# EAGLE schematic matriz_8x8 (EAGLE 9.0.0)
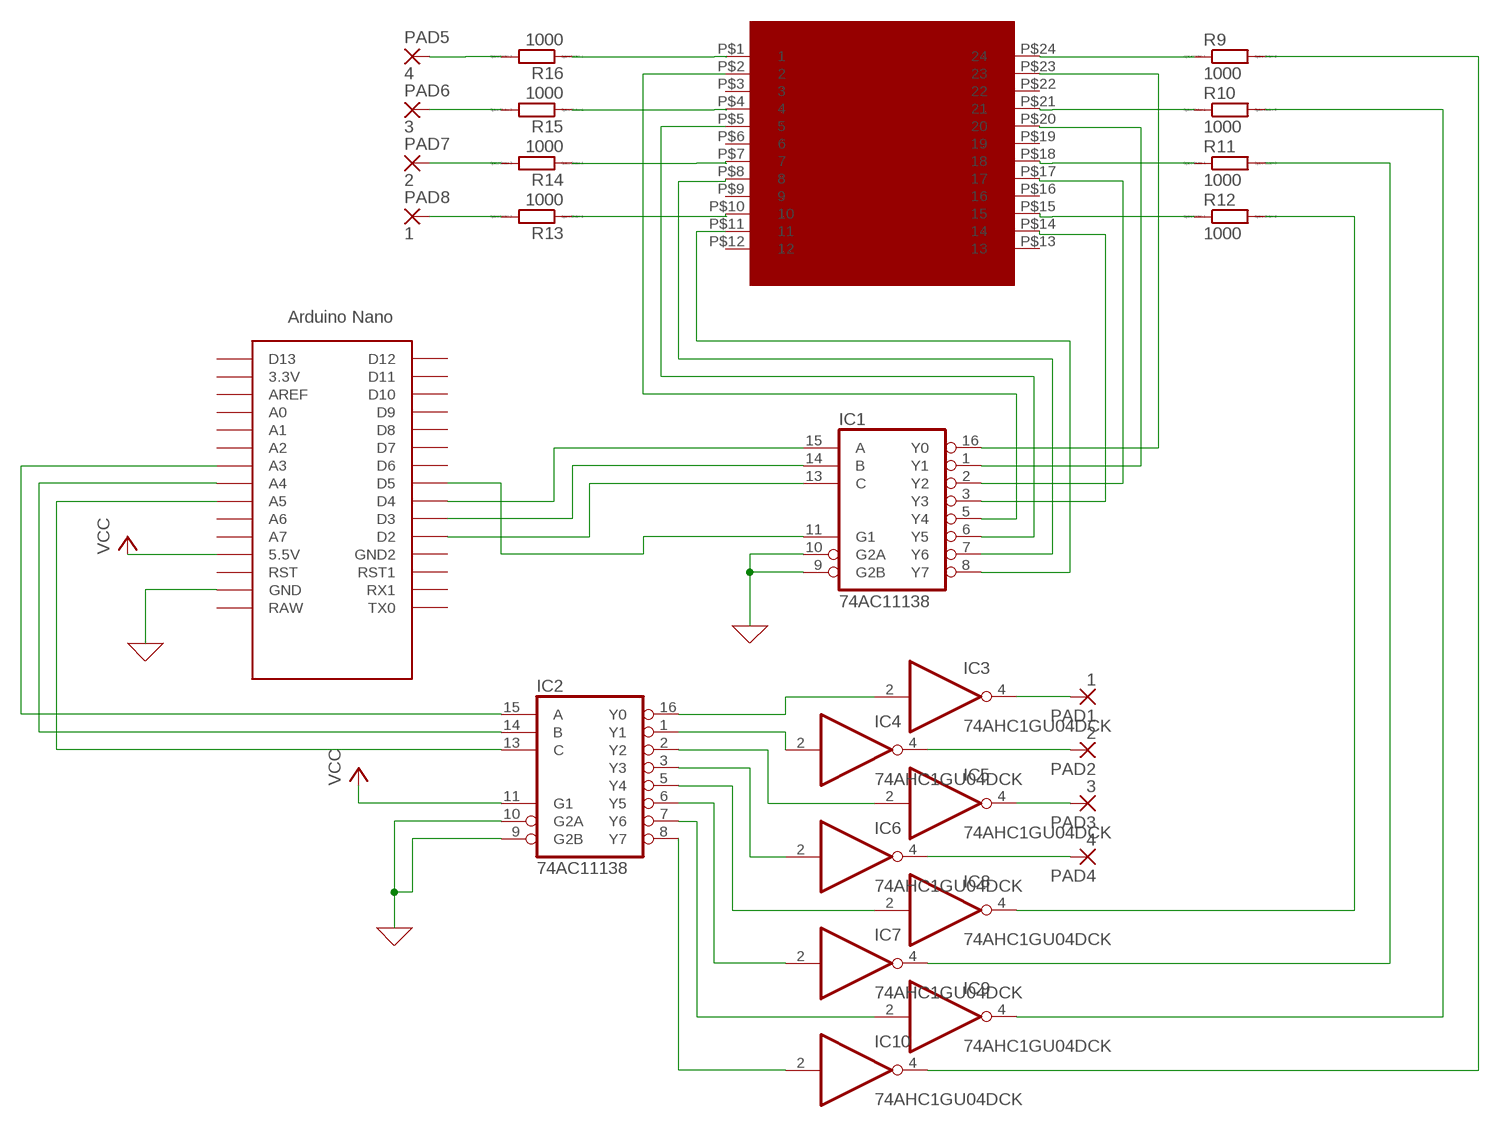
[diagram p0: schematic, sheet 1]

## Parts
IC1  74AC11138  [DIL16]
IC2  74AC11138  [DIL16]
IC3  74AHC1GU04DCK  [SC70-5]
IC4  74AHC1GU04DCK  [SC70-5]
IC5  74AHC1GU04DCK  [SC70-5]
IC6  74AHC1GU04DCK  [SC70-5]
IC7  74AHC1GU04DCK  [SC70-5]
IC8  74AHC1GU04DCK  [SC70-5]
IC9  74AHC1GU04DCK  [SC70-5]
IC10  74AHC1GU04DCK  [SC70-5]
PAD1  1  1,6/0,8  [1,6/0,8]
PAD2  2  1,6/0,8  [1,6/0,8]
PAD3  3  1,6/0,8  [1,6/0,8]
PAD4  4  1,6/0,8  [1,6/0,8]
PAD5  4  1,6/0,8  [1,6/0,8]
PAD6  3  1,6/0,8  [1,6/0,8]
PAD7  2  1,6/0,8  [1,6/0,8]
PAD8  1  1,6/0,8  [1,6/0,8]
R9  1000  R0204/7  [0204/7]
R10  1000  R0204/7  [0204/7]
R11  1000  R0204/7  [0204/7]
R12  1000  R0204/7  [0204/7]
R13  1000  R0204/7  [0204/7]
R14  1000  R0204/7  [0204/7]
R15  1000  R0204/7  [0204/7]
R16  1000  R0204/7  [0204/7]
U$1  8X8_BI_COLOR_MATRIX  [8X8_BI_COLOR_MATRIX]
U$2  NANO  [NANO]

## Nets
0: IC1.9(G2B) IC1.10(G2A) IC2.9(G2B) IC2.10(G2A) U$2.GND ; supply symbol labelled GND
N$1: IC1.11(G1) U$2.D5
N$9: R9.1 U$1.P$24
N$10: R10.1 U$1.P$21
N$11: R11.1 U$1.P$18
N$12: R12.1 U$1.P$15
N$13: R13.1 U$1.P$10
N$14: R14.1 U$1.P$7
N$15: R15.1 U$1.P$4
N$16: R16.1 U$1.P$1
N$17: IC2.13(C) U$2.A5
N$18: IC1.13(C) U$2.D2
N$19: IC1.14(B) U$2.D3
N$20: IC1.15(A) U$2.D4
N$21: IC2.15(A) U$2.A3
N$22: IC2.14(B) U$2.A4
N$23: IC2.16(Y0) IC3.2(I)
N$24: IC2.1(Y1) IC4.2(I)
N$25: IC2.2(Y2) IC5.2(I)
N$26: IC2.3(Y3) IC6.2(I)
N$27: IC2.5(Y4) IC8.2(I)
N$28: IC2.6(Y5) IC7.2(I)
N$29: IC2.7(Y6) IC9.2(I)
N$30: IC2.8(Y7) IC10.2(I)
N$31: PAD5.1(P) R16.2
N$32: PAD6.1(P) R15.2
N$33: PAD7.1(P) R14.2
N$34: PAD8.1(P) R13.2
N$35: IC1.8(Y7) U$1.P$11
N$36: IC1.7(Y6) U$1.P$8
N$37: IC1.6(Y5) U$1.P$5
N$38: IC1.5(Y4) U$1.P$2
N$39: IC1.3(Y3) U$1.P$14
N$43: IC3.4(O) PAD1.1(P)
N$44: IC4.4(O) PAD2.1(P)
N$45: IC5.4(O) PAD3.1(P)
N$46: IC6.4(O) PAD4.1(P)
N$47: IC8.4(O) R12.2
N$48: IC7.4(O) R11.2
N$49: IC9.4(O) R10.2
N$50: IC10.4(O) R9.2
N$52: IC1.2(Y2) U$1.P$17
N$54: IC1.16(Y0) U$1.P$23
N$55: IC1.1(Y1) U$1.P$20
VCC: IC2.11(G1) U$2.5V(5.5V)
Unconnected: U$1.P$3 U$1.P$6 U$1.P$9 U$1.P$12 U$1.P$13 U$1.P$16 U$1.P$19 U$1.P$22 U$2.3.3V U$2.A0 U$2.A1 U$2.A2 U$2.A6 U$2.A7 U$2.AREF U$2.D6 U$2.D7 U$2.D8 U$2.D9 U$2.D10 U$2.D11 U$2.D12 U$2.D13 U$2.GND1(GND2) U$2.ICSP1 U$2.ICSP2 U$2.ICSP3 U$2.ICSP4 U$2.ICSP5 U$2.ICSP6 U$2.RAW U$2.RST U$2.RST1 U$2.RX1 U$2.TX0

## Power pins joined to a net without a drawn wire
GND: IC1.4(GND) IC2.4(GND) IC3.3(GND) IC4.3(GND) IC5.3(GND) IC6.3(GND) IC7.3(GND) IC8.3(GND) IC9.3(GND) IC10.3(GND)
VCC: IC1.12(VCC) IC2.12(VCC) IC3.5(VCC) IC4.5(VCC) IC5.5(VCC) IC6.5(VCC) IC7.5(VCC) IC8.5(VCC) IC9.5(VCC) IC10.5(VCC)

## Library data of the parts
IC1 IC2 = 74ac-logic:74AC11138: 3 to 8 line DECODER/DEMULTIPLEXER
IC3-IC10 = 74xx-little-us:74*1GU04: Single Unbuffered Inverter
PAD1-PAD8 = wirepad:1,6/0,8: THROUGH-HOLE PAD
R9-R16 = eagle-ltspice:R: RESISTOR, European symbol; SPICEMODEL: NONE; SPICEPREFIX: R
U$1 = Daniel:8X8_BI_COLOR_MATRIX
U$2 = Arduino-clone:NANO: Arduino Nano